# Altium schematic sheet Main.SchDoc
size 420 x 297 mm; SheetNumber: 1; SheetTotal: 5
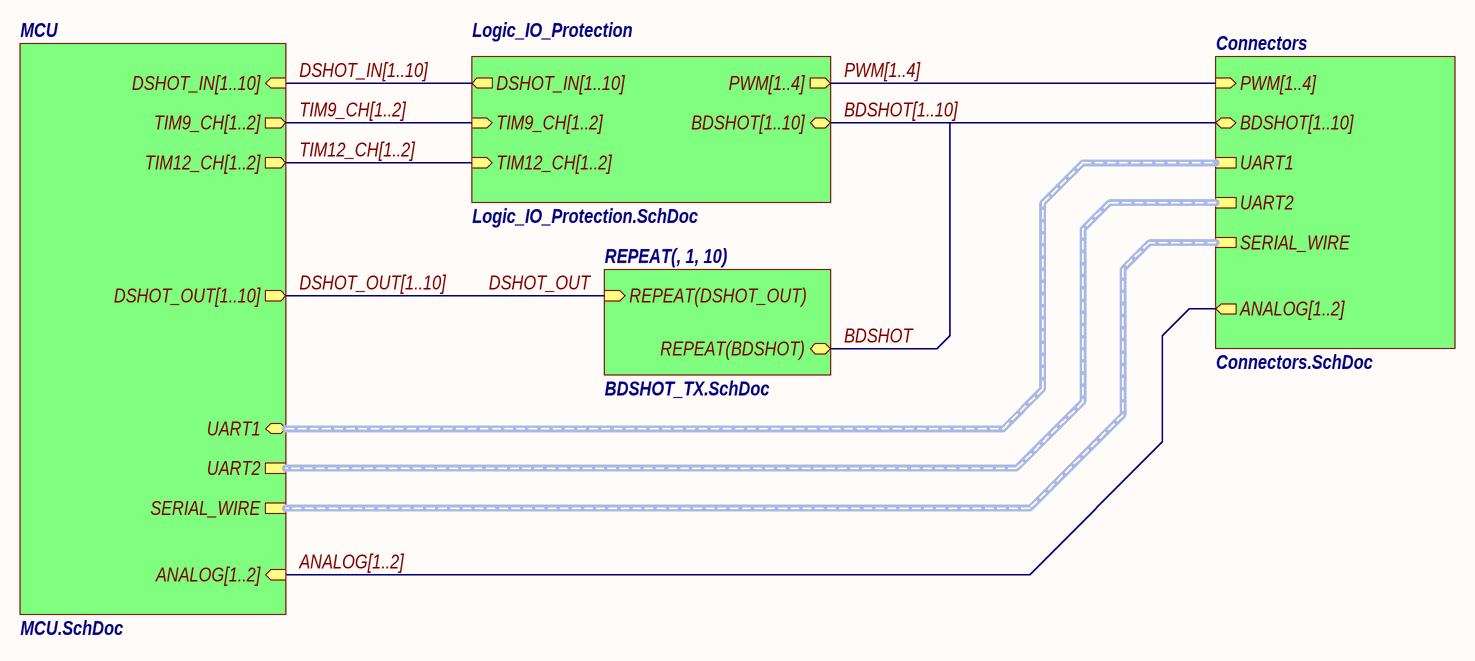
[diagram p0: Main.SchDoc]

## Sub-sheets
Connectors = Connectors.SchDoc: BDSHOT[1..10] (bidir), PWM[1..4] (in), UART1, UART2, SERIAL_WIRE, ANALOG[1..2] (out)
Logic_IO_Protection = Logic_IO_Protection.SchDoc: DSHOT_IN[1..10] (out), TIM9_CH[1..2] (in), TIM12_CH[1..2] (in), BDSHOT[1..10] (bidir), PWM[1..4] (out)
MCU = MCU.SchDoc: DSHOT_IN[1..10] (in), DSHOT_OUT[1..10] (out), TIM9_CH[1..2] (out), TIM12_CH[1..2] (out), UART1 (bidir), UART2, SERIAL_WIRE, ANALOG[1..2] (in)
REPEAT(, 1, 10) = BDSHOT_TX.SchDoc: REPEAT(DSHOT_OUT) (in), REPEAT(BDSHOT) (bidir)

## Nets
BDSHOT: sheet REPEAT(, 1, 10)/REPEAT(BDSHOT)
DSHOT_OUT: sheet REPEAT(, 1, 10)/REPEAT(DSHOT_OUT)

## Buses and harness runs
bus ANALOG[1..2] = sheet Connectors/ANALOG[1..2] = sheet MCU/ANALOG[1..2]
bus BDSHOT[1..10] = sheet Connectors/BDSHOT[1..10] = sheet Logic_IO_Protection/BDSHOT[1..10]
bus DSHOT_IN[1..10] = sheet Logic_IO_Protection/DSHOT_IN[1..10] = sheet MCU/DSHOT_IN[1..10]
bus DSHOT_OUT[1..10] = sheet MCU/DSHOT_OUT[1..10]
bus PWM[1..4] = sheet Connectors/PWM[1..4] = sheet Logic_IO_Protection/PWM[1..4]
bus TIM9_CH[1..2] = sheet Logic_IO_Protection/TIM9_CH[1..2] = sheet MCU/TIM9_CH[1..2]
bus TIM12_CH[1..2] = sheet Logic_IO_Protection/TIM12_CH[1..2] = sheet MCU/TIM12_CH[1..2]
harness sheet Connectors/SERIAL_WIRE = sheet MCU/SERIAL_WIRE
harness sheet Connectors/UART1 = sheet MCU/UART1
harness sheet Connectors/UART2 = sheet MCU/UART2

## Notes on the sheet
- Перв. примен.
- Справ. №
- Подп. и дата
- Инв. № дубл.
- Взам. инв. №
- Разраб.
- Изм.
- Лист
- № докум.
- Подп.
- Дата
- Лит.
- Масса
- Масштаб
- Пров.
- Т.контр.
- Схема электрическая принципиальная
- Листов
- Инв. № подл.
- Утв.
- Н.контр.
- Копировал
- Формат А3